# EAGLE design Adafruit USB C microlipo charger (EAGLE 9.5.0)
AUTHOR: K. TOWNSEND
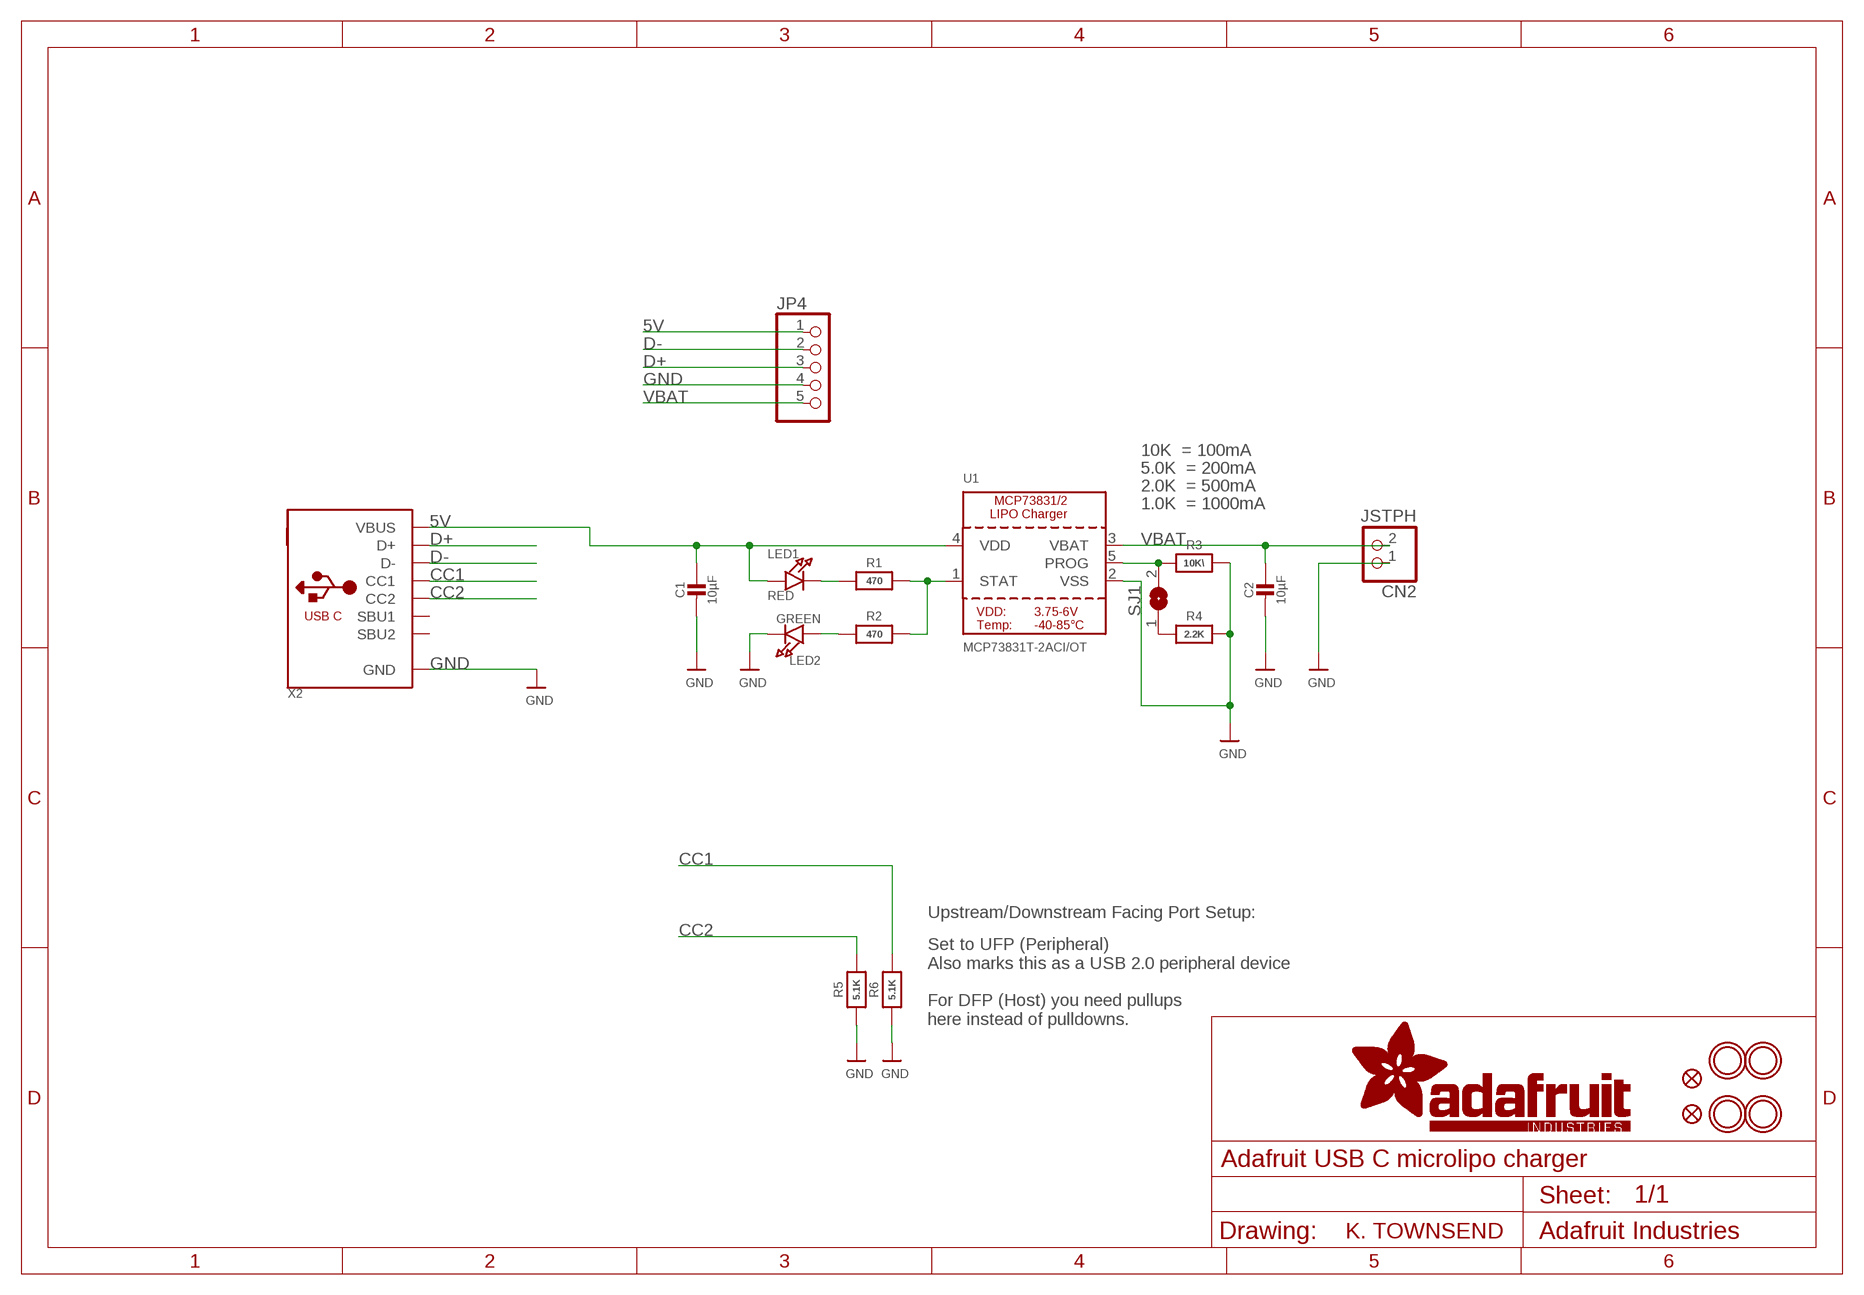
[diagram p0: schematic, sheet 1]

## Parts
C1  10µF  CAP_CERAMIC0805-NOOUTLINE  [0805-NO@1]
C2  10µF  CAP_CERAMIC0805-NOOUTLINE  [0805-NO@1]
CN2  JSTPH  JST_2PIN  [JSTPH2]
FID1  FIDUCIAL""  [FIDUCIAL_1MM]
FID2  FIDUCIAL""  [FIDUCIAL_1MM]
JP4  HEADER-1X570MIL  [1X05_ROUND_70]
LED1  RED  LED0805_NOOUTLINE  [CHIPLED_0805_NOOUTLINE]
LED2  GREEN  LED0805_NOOUTLINE  [CHIPLED_0805_NOOUTLINE]
R1  470  RESISTOR_0603_NOOUT  [0603-NO]
R2  470  RESISTOR_0603_NOOUT  [0603-NO]
R3  10K\  RESISTOR_0603_NOOUT  [0603-NO]
R4  2.2K  RESISTOR_0603_NOOUT  [0603-NO]
R5  5.1K  RESISTOR_0603_NOOUT  [0603-NO]
R6  5.1K  RESISTOR_0603_NOOUT  [0603-NO]
SJ1  SOLDERJUMPER  [SOLDERJUMPER_ARROW_NOPASTE]
U1  MCP73831T-2ACI/OT  MCP73831/2  [SOT23-5]
U$9  MOUNTINGHOLE2.5  [MOUNTINGHOLE_2.5_PLATED]
U$10  MOUNTINGHOLE2.5  [MOUNTINGHOLE_2.5_PLATED]
U$11  MOUNTINGHOLE2.5  [MOUNTINGHOLE_2.5_PLATED]
U$12  MOUNTINGHOLE2.5  [MOUNTINGHOLE_2.5_PLATED]
X2  USB_C  [USB_C_CUSB31-CFM2AX-01-X]

## Nets
5V: C1.1 JP4.1 LED1.A U1.4(VDD) X2.A4B9(VBUS) X2.B4A9(VBUS)
CC1: R6.2 X2.A5(CC1)
CC2: R5.2 X2.B5(CC2)
D+: JP4.3 X2.A6(D+) X2.B6(D+)
D-: JP4.2 X2.A7(D-) X2.B7(D-)
GND: C1.2 C2.2 CN2.1 JP4.4 LED2.C R3.2 R4.2 R5.1 R6.1 U1.2(VSS) X2.A1B12(GND) X2.B1A12(GND)
N$1: LED1.C R1.1
N$2: R1.2 R2.2 U1.1(STAT)
N$3: R4.1 SJ1.1
N$5: R3.1 SJ1.2 U1.5(PROG)
N$6: LED2.A R2.1
VBAT: C2.1 CN2.2 JP4.5 U1.3(VBAT)
Unconnected: X2.A8(SBU1) X2.B8(SBU2)

## Notes on the sheet
- 10K  = 100mA
- 5.0K  = 200mA
- 2.0K  = 500mA
- 1.0K  = 1000mA
- Upstream/Downstream Facing Port Setup:
- Set to UFP (Peripheral)
  Also marks this as a USB 2.0 peripheral device
  
  For DFP (Host) you need pullups
  here instead of pulldowns.

## Library data of the parts
C1 C2 = microbuilder:CAP_CERAMIC: Ceramic Capacitors For new designs, use the packages preceded by an '_' character since they are more reliable: The following footprints should be used on most boards: _0402 - Standard footprint for regular board layouts _0603 - Standard footprint for regular board layouts _0805 - Standard footprint for regular board layouts _1206 - Standard footprint for regular board layouts For extremely tight-pitch boards where space is at a premium, the following 'micro-pitch' footprints can be used (smaller pads, no silkscreen outline, etc.): _0402MP - Micro-pitch footprint for very dense/compact boards _0603MP - Micro-pitch footprint for very dense/compact boards _0805MP - Micro-pitch footprint for very dense/compact boards _1206MP - Micro-pitch footprint for very dense/compact boards
CN2 = microbuilder:JST_2PIN: JST 2-Pin Right-Angle Connector PH-Series - 4UConnector: 17311 SH-Series - 4UConnector: 07278
FID1 FID2 = microbuilder:FIDUCIAL: Fiducial Alignment Points Various fiducial points for machine vision alignment.; BOM: EXCLUDE
JP4 = microbuilder:HEADER-1X5: PIN HEADER
LED1 LED2 = microbuilder:LED: LED 0603 - 0603 Surface Mount Package 2mA: Green LED - Low Power (3.9mcd, 2ma, 1.7Vf) - Digikey: 475-2709-2-ND Orange LED - Low Power (9.8mcd, 2ma, 1.8Vf) - Digikey: 475-1194-2-ND Red LED - Low Power (5mcd, 2ma, 1.8Vf) - Digikey: 475-1195-2-ND Yellow LED - Low Power (7mcd, 2ma, 1.8Vf) - Digikey: 475-1196-2-ND 5mA: Blue LED - Low Power (17mcd, 5ma, 2.9Vf) - Digikey: LNJ937W8CRACT-ND 0805 - 0805 Surface Mount Package 2mA: Red LED (8.8mcd, 2mA, 1.8Vf, Clear) - Low Power [Digikey: 475-2510-1-ND] Green LED (5mcd, 2mA, 1.8Vf, Clear) - Low Power [Digikey: 475-2730-1-ND] Yellow LED (11.3mcd, 2mA, 1.8Vf, Clear) - Low Power [Digikey: 475-2555-1-ND] 20mA: Red LED (104mcd, 20mA, Diffused) - LS R976 [Digikey: 475-1278-6-ND] Red LED (12mcd, 20mA, 2.0Vf, Clear) - APT2012EC [Digikey: 754-1128-1-ND] Green LED (15mcd, 20mA, 2.2Vf, Clear) - APT2012GC [Digikey: 754-1131-1-ND] Orange LED (160mcd, 20mA, 2.1Vf, Clear) - APT2012SECK [Digikey: 754-1130-1-ND] 1206 - 1206 Surface Mount Package Green LED (26mcd, 20mA, Diffused) - LG N971 [Digikey: 475-1407-6-ND] Red LED (15mcd, 20mA, Diffused) - LH N974 [Digikey: 475-1416-6-ND] Cree - Cree High-Power Surface Mount LEDs XPEBWT-L1-0000-00D50 - White 111lm 350mA 2.9Vf 6200K 110° XTEAWT-00-0000-00000LEE3 - White 114lm 350mA 2.85Vf 5000K 115° Everlight - Everlight 45-21 Series Surface Mount LEDs 45-21/QK2C-B2832AC2CB2/2T - Warm White 2000mcd 20mA 3.25Vf 3050K 120° 45-21/LK2C-B38452C4CB2/2T - Nuetral White 2000mcd 20mA 3.25Vf 4150K 120° 45-21/LK2C-B50634C6CB2/2T - Cold White 2200mcd 20mA 3.25Vf 5650K 120° PLCC2 Reverse Mount LS T77K-J1L2-1-0-2-R18-Z - Red 11.25mcd 2mA 1.8Vf 630nm 120° LO T77K-L1M2-24-Z - Orange 19.6mcd 2mA 1.8Vf 606nm 120° LY T77K-K2M1-26-Z - Yellow 15.7mcd 2mA 1.8Vf 587nm 120°
R1-R6 = microbuilder:RESISTOR: Resistors For new designs, use the packages preceded by an '_' character since they are more reliable: The following footprints should be used on most boards: _0402 - Standard footprint for regular board layouts _0603 - Standard footprint for regular board layouts _0805 - Standard footprint for regular board layouts _1206 - Standard footprint for regular board layouts For extremely tight-pitch boards where space is at a premium, the following 'micro-pitch' footprints can be used (smaller pads, no silkscreen outline, etc.): _0402MP - Micro-pitch footprint for very dense/compact boards _0603MP - Micro-pitch footprint for very dense/compact boards _0805MP - Micro-pitch footprint for very dense/compact boards _1206MP - Micro-pitch footprint for very dense/compact boards
SJ1 = microbuilder:SOLDERJUMPER: SMD Solder JUMPER Solder the two pads together to create a connection, or remove the solder to break it. REFLOW - Use this footprint for solder paste and reflow ovens. WAVE - Use this footprint for hand-soldering (larger pads). CLOSED - Has a trace between the two pads to ensure it is closed by default. The trace needs to be cut to disable the jumper, and can be closed again by creating a solder bridge between the two pads.; BOM: EXCLUDE
U1 = microbuilder:MCP73831/2: MCP73831/2 LIPO Charger VDD: 3.75 - 6V Temp -40 - 85°C Programmable Charge Rate: 15-500mA NOTE: STAT is a tri-state logic output on the MCP73831 and an open-drain output on the MCP73832. SOT23-5 with 4.2V output and tri-state logic on STAT = MCP73831T-2ACI/OT
U$9-U$12 = microbuilder:MOUNTINGHOLE: Mounting Hole For #2 screws (0.086"/2.18mm width, 0.094"/2.4mm hole) use 2.5mm; BOM: EXCLUDE
X2 = microbuilder:USB_C: USB Type-C USB 2.0 Connector

## Board
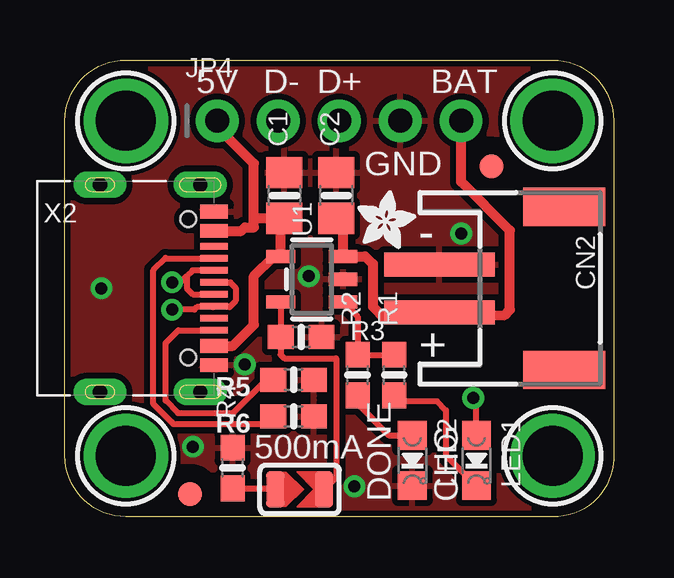
[diagram p1: board, top side]
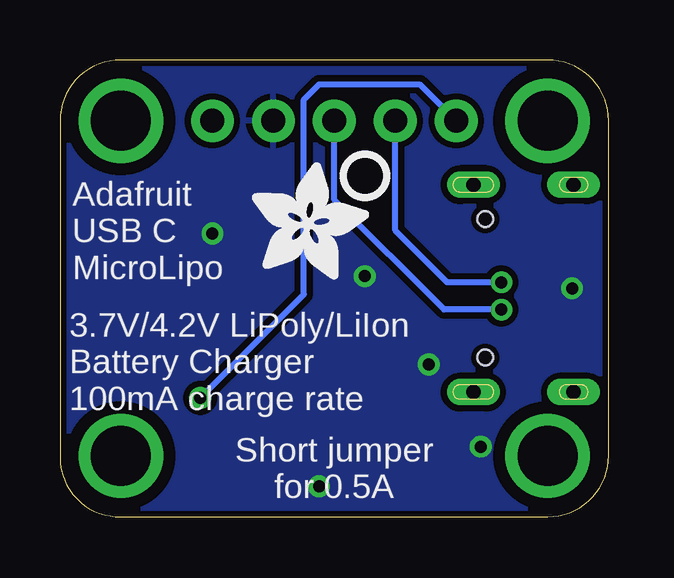
[diagram p2: board, bottom side, seen from below]

Size 22.86 x 19.05 mm. Coordinates in mm from the lower left corner, seen from the top.
Outline: 2.54,19.05 20.32,19.05 arc-90 22.86,16.51 22.86,2.41 arc-90 20.32,0 2.54,0 arc-90 0,2.54 0,16.51 arc-90 2.54,19.05
Copper layers (1*16): Top 0.035mm / dielectric 1.5mm / Bottom 0.035mm
Design rules "adafruit": minimum track width 8mil, minimum drill 15.5mil, track to track 8mil, track to pad 8mil, pad to pad 8mil, via to via 8mil, smd to smd 8mil, copper to edge 10mil, drill to drill 8mil, minimum pad ring 10mil, minimum via ring 8mil, stop-mask expansion 2mil, vias tented up to drill 20mil, thermal gap 10mil

### Footprints (pad centres in the part's own frame; a part is rotated, then mirrored left to right if it is on the bottom)
0805-NO@1 = smd 1.3 x 1.5: 1 -0.95,0; 2 0.95,0
JSTPH2 = smd 1 x 4.6: 1 -1,-3.7; 2 1,-3.7 | smd 1.6 x 3.4: NC1 -3.4,1.5; NC2 3.4,1.5
FIDUCIAL_1MM = smd 1 x 1: 1 0,0
1X05_ROUND_70 = drill 1 pad 1.778: 1 -5.08,0; 2 -2.54,0; 3 0,0; 4 2.54,0; 5 5.08,0
CHIPLED_0805_NOOUTLINE = smd 1.2 x 1.2: A 0,-1.05; C 0,1.05
0603-NO = smd 1.075 x 1: 1 -0.85,0; 2 0.85,0
SOLDERJUMPER_ARROW_NOPASTE = smd 0.762 x 1.524: 1 -1.016,0; 2 1.016,0
SOT23-5 = smd 0.55 x 1.2: 1 -0.95,-1.3; 2 0,-1.3; 3 0.95,-1.3; 4 0.95,1.3; 5 -0.95,1.3
MOUNTINGHOLE_2.5_PLATED = drill 2.5 pad 3.2: P$1 0,0
USB_C_CUSB31-CFM2AX-01-X = smd 0.575 x 1.15: A1B12 -3.2,7.355; A4B9 -2.4,7.355; B1A12 3.2,7.355; B4A9 2.4,7.355 | smd 0.275 x 1.15: A5 -1.25,7.355; A6 -0.25,7.355; A7 0.25,7.355; A8 1.25,7.355; B5 1.75,7.355; B6 0.75,7.355; B7 -0.75,7.355; B8 -1.75,7.355 | drill 0.6 pad 1 long: M1 -4.32,6.78; M2 4.32,6.78; M3 -4.32,2.6; M4 4.32,2.6 | hole 0.65: 2.89,6.28; -2.89,6.28

### Placement (x,y rotation side)
C1  9.14,13.4 90 top
C2  11.3,13.4 90 top
CN2  19.3,9.53 270 top
FID1  5.21,0.95 0 top
FID2  17.78,14.61 0 top
JP4  11.43,16.51 0 top
LED1  17.14,2.35 180 top
LED2  14.48,2.35 180 top
R1  13.72,5.91 90 top
R2  12.19,5.91 90 top
R3  9.84,7.49 0 top
R4  6.99,2.03 90 top
R5  9.53,5.71 180 top
R6  9.53,4.19 180 top
SJ1  9.78,1.14 0 top
U1  10.29,9.91 90 top
U$2  [ADAFRUIT_2.5MM]  12.19,11.18 0 top
U$9  20.32,2.54 0 top
U$10  20.32,16.51 0 top
U$11  2.54,2.54 0 top
U$12  2.54,16.51 0 top
U$13  [ADAFRUIT_5MM]  14.86,9.91 0 bottom
U$16  [PCBFEAT-REV-040]  10.16,14.22 0 bottom
X2  -1.14,9.53 270 top

### Tracks (layer width: path | path; a pad name or v marks a point on that pad's centre or on a via)
5V  (via drill 0.5)
  Top 0.254: LED1.A 17.14,4.83 v17.02,4.95
  Top 0.406: X2.A4B9 7.36,11.93 7.5,12.07 7.87,12.07 7.87,12.45 | 7.87,12.45 C1.1 8.99,12.29 U1.4 8.7,10.86 7.87,10.03 7.87,8 7,7.12 X2.B4A9 | JP4.1 6.35,16.26 7.87,14.73 7.87,12.45
  Bottom 0.254: v17.02,4.95 12.7,9.27 12.7,17.4 12.06,18.03 7.87,18.03 JP4.1
CC1
  Top 0.254: R6.2 8.35,3.86 4.53,3.86 4.45,3.94 3.68,4.7 3.68,10.29 4.19,10.79 4.21,10.78 X2.A5
CC2
  Top 0.254: R5.2 8.38,5.71 6.99,4.32 4.72,4.32 4.19,4.85 4.19,7.24 4.73,7.78 X2.B5
D+  (via drill 0.5)
  Top 0.254: X2.A6 6.89,9.78 7.12,9.55 7.12,9 6.86,8.74 6.86,8.76 6.22,8.76 X2.B6 6.18,8.74 5.5,8.74 5.39,8.64 v4.47,8.64
  Bottom 0.254: v4.47,8.64 6.86,8.64 11.43,13.21 JP4.3
D-  (via drill 0.5)
  Top 0.254: X2.B7 5.32,10.28 5.08,10.03 | 5.08,10.03 5.08,9.53 5.33,9.27 5.34,9.28 X2.A7 | 5.08,10.03 4.83,9.78 v4.47,9.78
  Bottom 0.254: v4.47,9.78 6.73,9.78 8.89,11.94 JP4.2
GND  (via drill 0.5)
  other vias: 12.06,1.27 16.51,11.81 1.52,9.53 10.16,10.03 5.33,2.92 7.49,6.35
  pour Top (isolate 0.254): 0,0 0,19.05 22.86,19.05 22.86,0
  pour Bottom (isolate 0.254): 0,19.05 22.86,19.05 22.86,0 0,0
N$1
  Top 0.254: R1.1 13.95,4.83 15.49,4.83 15.88,4.45 15.88,2.57 LED1.C
N$2
  Top 0.254: U1.1 12.19,8.35 R2.2 R1.2
N$3
  Top 0.254: R4.1 9.18,1.18 9.14,1.14 SJ1.1
N$5
  Top 0.254: U1.5 R3.1 8.99,6.75 9.14,6.6 11.3,6.6 11.3,1.65 SJ1.2
N$6
  Top 0.254: R2.1 12.19,4.7 13.49,3.4 LED2.A
VBAT
  Top 0.406: C2.1 11.59,12.16 U1.3 12.51,10.86 12.83,10.54 12.83,8.76 13.34,8.26 15.46,8.26 CN2.2 18.3,8.4 18.54,8.64 18.54,11.94 16.51,13.97 JP4.5

### Text on the board
tPlace: 5V | D- | D+ | BAT | GND | - | + | 500mA | DONE | CHG
bPlace: Adafruit / USB C / MicroLipo | 3.7V/4.2V LiPoly/LiIon / Battery Charger / 100mA charge rate | Short jumper / for 0.5A